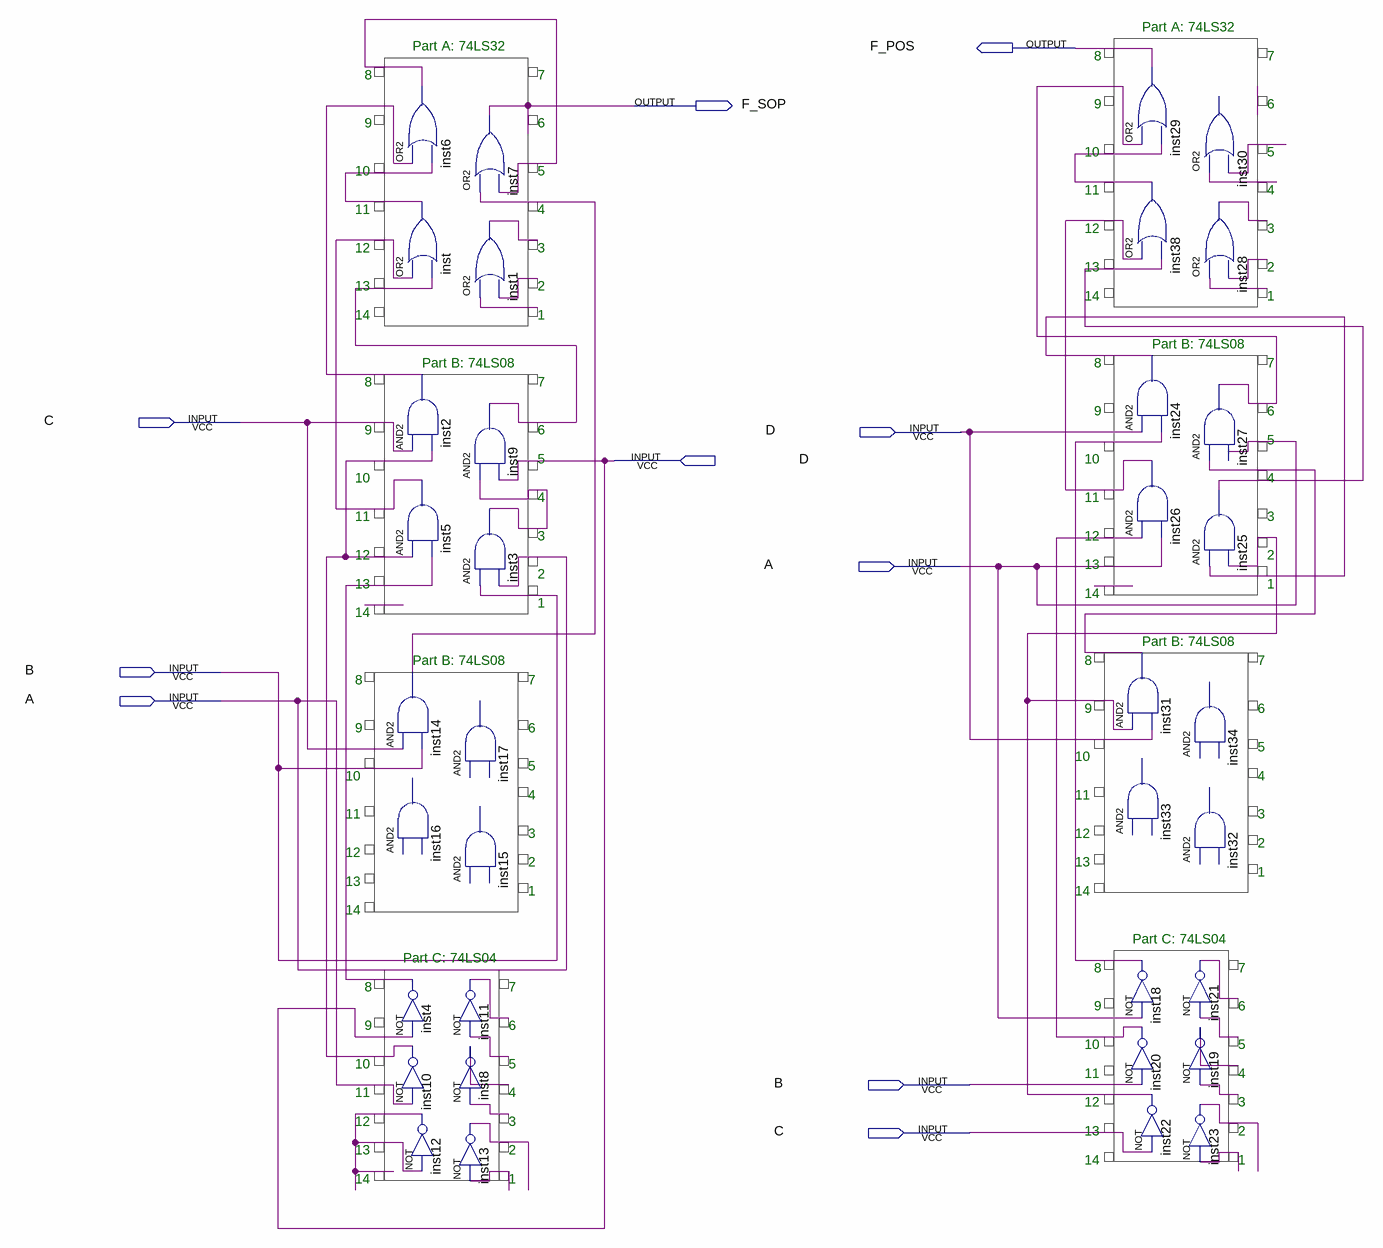
[diagram p0: schematic sheet]
// Quartus schematic lab.bdf as structural Verilog: 36 symbols, 10 pins
module lab (
  input  C,
  input  D,
  input  A,
  input  B,
  output F_POS,
  output F_SOP
);

  wire inst1_out, inst2_out, inst3_out, inst4_out, inst5_out, inst6_out, inst8_out, inst9_out, inst10_out,
       inst11_out, inst12_out, inst13_out, inst14_out, inst18_out, inst19_out, inst20_out, inst21_out,
       inst22_out, inst23_out, inst24_out, inst25_out, inst26_out, inst27_out, inst28_out, inst31_out,
       inst38_out, inst_out, undriven, undriven_2, undriven_3, undriven_4, undriven_5, undriven_6,
       undriven_7, undriven_8, undriven_9, undriven_10, undriven_11, undriven_12;

  or inst6 (inst6_out, inst2_out, inst_out);
  or inst (inst_out, inst5_out, inst9_out);
  and inst2 (inst2_out, C, inst10_out);
  and inst5 (inst5_out, inst10_out, inst4_out);
  and inst14 (inst14_out, C, B);
  // AND2 inst16 is placed but not wired
  not inst4 (inst4_out, D);
  not inst10 (inst10_out, A);
  not inst12 (inst12_out, inst12_out);
  or inst7 (F_SOP, inst14_out, inst6_out);
  or inst1 (inst1_out, undriven_2, undriven);
  and inst9 (inst9_out, inst3_out, D);
  and inst3 (inst3_out, B, A);
  // AND2 inst17 is placed but not wired
  // AND2 inst15 is placed but not wired
  not inst11 (inst11_out, undriven_3);
  not inst8 (inst8_out, undriven_4);
  not inst13 (inst13_out, undriven_5);
  and inst31 (inst31_out, inst22_out, D);
  // AND2 inst33 is placed but not wired
  or inst29 (F_POS, inst27_out, inst38_out);
  // OR2 inst30 has open pins: IN1=undriven_12, IN2=undriven_6, OUT=open
  or inst38 (inst38_out, inst26_out, inst25_out);
  or inst28 (inst28_out, undriven_8, undriven_7);
  and inst24 (inst24_out, D, inst18_out);
  and inst27 (inst27_out, inst31_out, A);
  and inst26 (inst26_out, inst20_out, A);
  and inst25 (inst25_out, inst24_out, inst22_out);
  // AND2 inst34 is placed but not wired
  // AND2 inst32 is placed but not wired
  not inst18 (inst18_out, A);
  not inst21 (inst21_out, undriven_9);
  not inst19 (inst19_out, undriven_10);
  not inst20 (inst20_out, B);
  not inst22 (inst22_out, C);
  not inst23 (inst23_out, undriven_11);

  // Notes on the sheet:
  //   Part A: 74LS32
  //   Part A: 74LS32
  //   8
  //   7
  //   8
  //   7
  //   9
  //   6
  //   9
  //   6
  //   10
  //   5
  //   10
  //   5
  //   11
  //   4
  //   11
  //   4
  //   12
  //   3
  //   12
  //   3
  //   13
  //   2
  //   13
  //   2
  //   14
  //   1
  //   14
  //   1
  //   Part B: 74LS08
  //   Part B: 74LS08
  //   8
  //   7
  //   8
  //   7
  //   9
  //   6
  //   9
  //   6
  //   5
  //   5
  //   10
  //   10
  //   4
  //   4
  //   11
  //   11
  //   3
  //   3
  //   12
  //   12
  //   2
  //   13
  //   2
  //   13
  //   1
  //   14
  //   1
  //   14
  //   Part B: 74LS08
  //   Part B: 74LS08
  //   8
  //   7
  //   8
  //   7
  //   9
  //   6
  //   9
  //   6
  //   5
  //   10
  //   5
  //   10
  //   4
  //   4
  //   11
  //   11
  //   3
  //   3
  //   12
  //   2
  //   12
  //   2
  //   13
  //   1
  //   13
  //   1
  //   14
  //   14
  //   Part C: 74LS04
  //   Part C: 74LS04
  //   8
  //   7
  //   8
  //   7
  //   9
  //   6
  //   9
  //   6
  //   10
  //   5
  //   10
  //   5
  //   11
  //   4
  //   11
  //   4
  //   12
  //   3
  //   12
  //   3
  //   13
  //   2
  //   13
  //   2
  //   14
  //   1
  //   14
  //   1
endmodule
